# EAGLE design Lightpack7.0L (EAGLE 6.3)
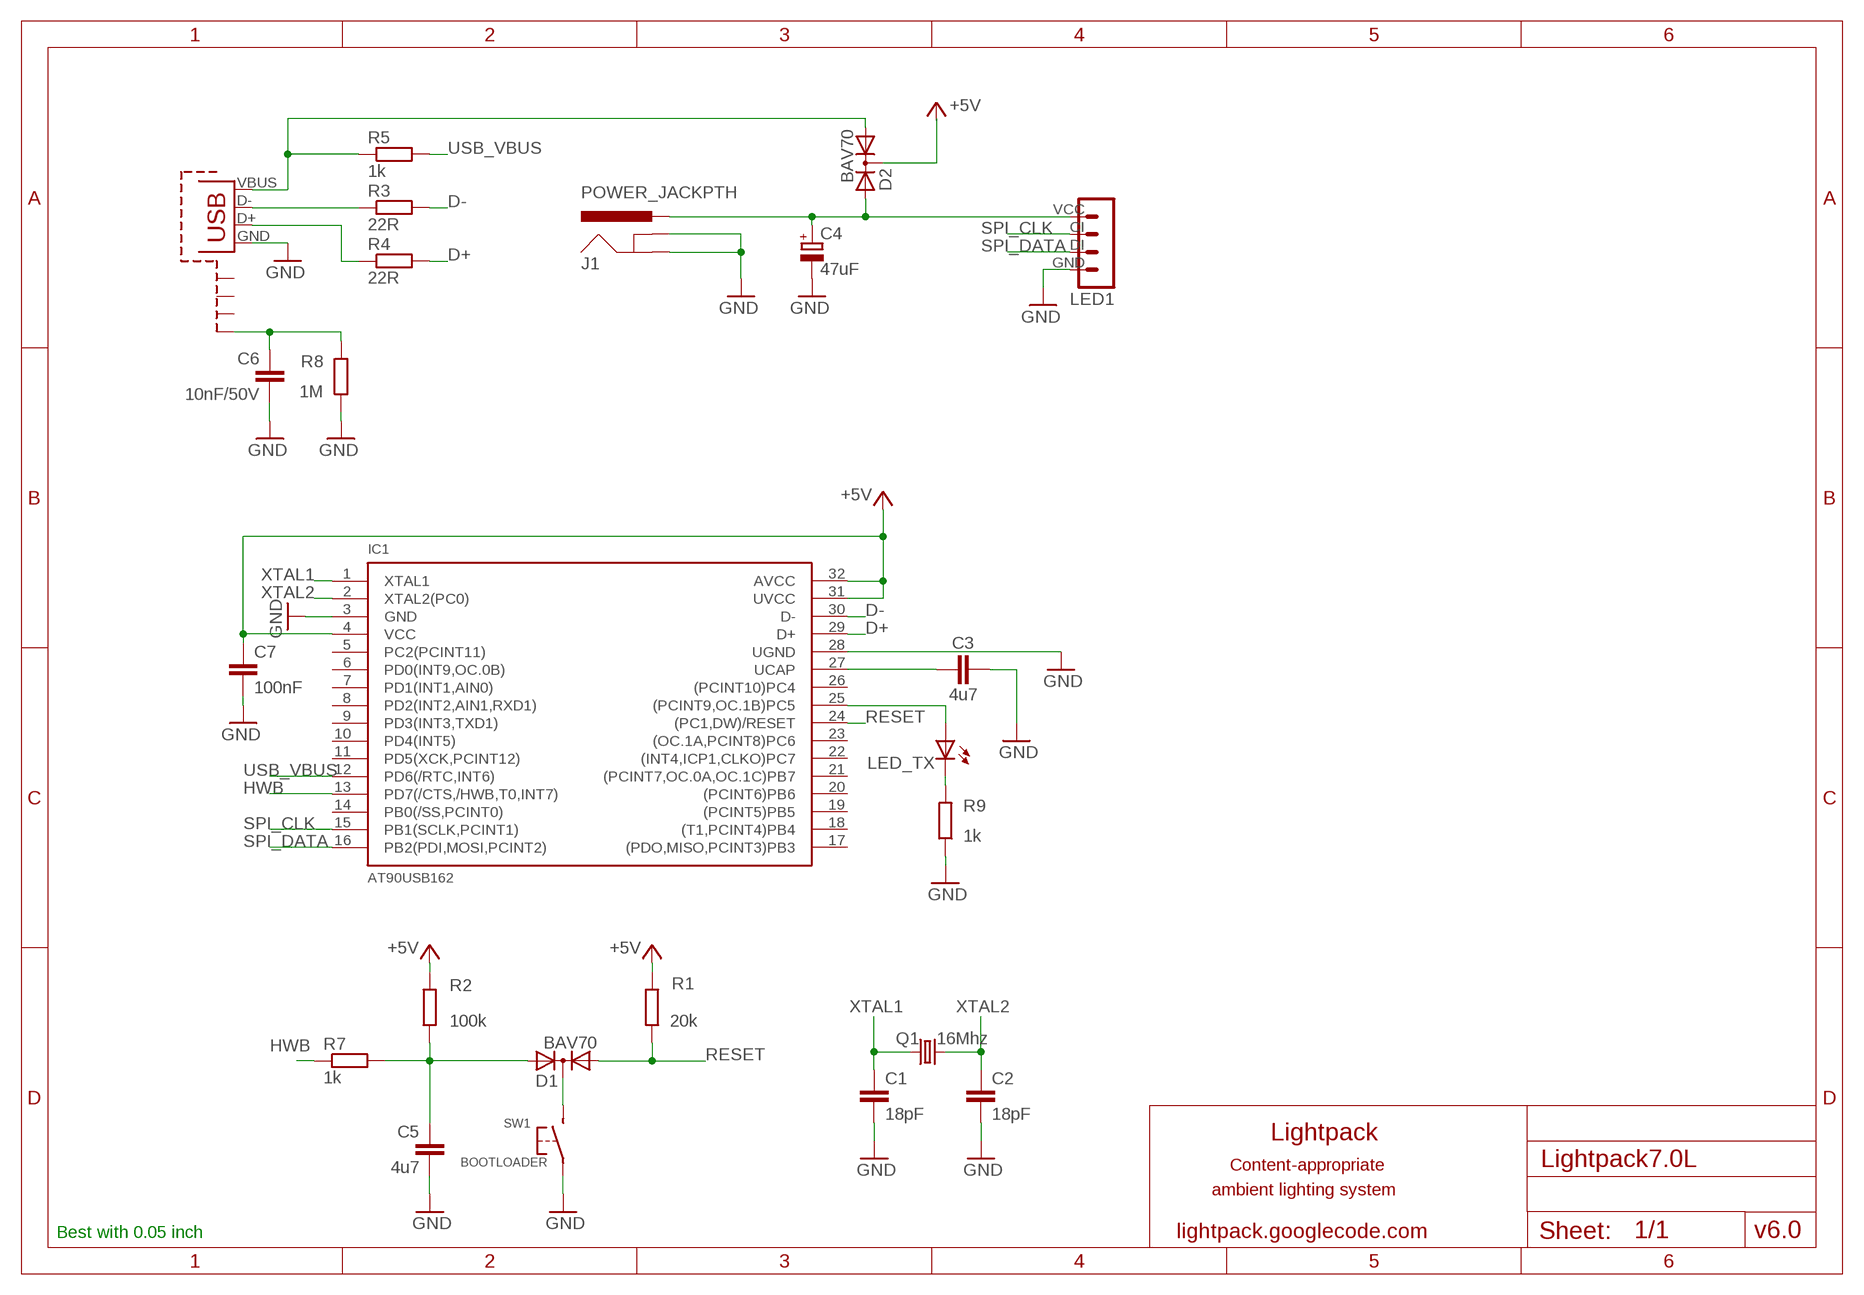
[diagram p0: schematic, sheet 1]

## Parts
C1  18pF  C-EUC1206  [C1206]
C2  18pF  C-EUC1206  [C1206]
C3  4u7  C-EUC1206  [C1206]
C4  47uF  CPOL-EUD/7343-31W  [D/7343-31W]
C5  4u7  C-EUC1206  [C1206]
C6  10nF/50V  C-EUC1206  [C1206]
C7  100nF  C-EUC1206  [C1206]
D1  BAV70  DIODE-2AC|CASOT23  [SOT23]
D2  BAV70  DIODE-2AC|CASOT23  [SOT23]
IC1  AT90USB162  [TQFP32]
J1  POWER_JACKPTH  [POWER_JACK_PTH]
LED1  RGB_LED_STRIP  [MA04-1]
LED_TX  GREEN  LEDCHIPLED_0805  [CHIPLED_0805]
Q1  16Mhz  CRYSTALHC49UP  [HC49UP]
R1  20k  R-EU_R1206  [R1206]
R2  100k  R-EU_R1206_2  [R1206]
R3  22R  R-EU_R1206  [R1206]
R4  22R  R-EU_R1206  [R1206]
R5  1k  R-EU_R1206  [R1206]
R7  1k  R-EU_R1206  [R1206]
R8  1M  R-EU_R1206  [R1206]
R9  1k  R-EU_R1206  [R1206]
SW1  BOOTLOADER  BUTTON  [BUTTON-SMD]
X1  USB-MB-S  [USB-MB-S]

## Nets
+5V [VCC]: C7.1 IC1.4(VCC) IC1.31(UVCC) IC1.32(AVCC) R1.2 R2.1
D+: IC1.29(D+) R4.2
D-: IC1.30(D-) R3.2
GND: C1.2 C2.2 C3.1 C4.- C5.2 C6.2 C7.2 IC1.3(GND) IC1.28(UGND) J1.GND J1.GNDBREAK LED1.GND R8.1 R9.1 SW1.1 X1.GND
HWB: IC1.13(PD7(/CTS,/HWB,T0,INT7)) R7.1
N$1: R4.1 X1.D+
N$2 [VCC]: D2.1(A1) R5.1 X1.VBUS
N$3: R3.1 X1.D-
N$5: D2.3(C)
N$6: C4.+ D2.2(A2) J1.PWR LED1.VCC
N$8: IC1.25((PCINT9,OC.1B)PC5) LED_TX.A
N$35: C6.1 R8.2 X1.SHIELD4
N$37: LED_TX.C R9.2
N$45: D1.3(C) SW1.2
N$47: C5.1 D1.2(A2) R2.2 R7.2
N$60: C3.2 IC1.27(UCAP)
RESET: D1.1(A1) IC1.24((PC1,DW)/RESET) R1.1
SPI_CLK: IC1.15(PB1(SCLK,PCINT1)) LED1.CI
SPI_DATA: IC1.16(PB2(PDI,MOSI,PCINT2)) LED1.DI
USB_VBUS: IC1.12(PD6(/RTC,INT6)) R5.2
XTAL1: C1.1 IC1.1(XTAL1) Q1.1
XTAL2: C2.1 IC1.2(XTAL2(PC0)) Q1.2
Unconnected: IC1.5(PC2(PCINT11)) IC1.6(PD0(INT9,OC.0B)) IC1.7(PD1(INT1,AIN0)) IC1.8(PD2(INT2,AIN1,RXD1)) IC1.9(PD3(INT3,TXD1)) IC1.10(PD4(INT5)) IC1.11(PD5(XCK,PCINT12)) IC1.14(PB0(/SS,PCINT0)) IC1.17((PDO,MISO,PCINT3)PB3) IC1.18((T1,PCINT4)PB4) IC1.19((PCINT5)PB5) IC1.20((PCINT6)PB6) IC1.21((PCINT7,OC.0A,OC.1C)PB7) IC1.22((INT4,ICP1,CLKO)PC7) IC1.23((OC.1A,PCINT8)PC6) IC1.26((PCINT10)PC4) X1.SHIELD1 X1.SHIELD2 X1.SHIELD3

## Notes on the sheet
- Lightpack
- Content-appropriate
- ambient lighting system
- Best with 0.05 inch | lightpack.googlecode.com | v6.0

## Library data of the parts
C1-C3 C5-C7 = rcl:C-EU: CAPACITOR, European symbol
C4 = rcl:CPOL-EU: POLARIZED CAPACITOR, European symbol
D1 D2 = diode:DIODE-2AC|CA: Dual DIODE Anode-Cathode|Cathode-Anode
IC1 = AT90USB:AT90USB162: AT90USB162 Author: brunql.github.com
J1 = SparkFun:POWER_JACK: Power Jack This is the standard 5.5mm barrel jack for power. The PTH is the most common, proven, reliable, footprint. All others are experimental. The Slot footprint only works if the mill layer is transmitted to the PCB fab house so be warned. Spark Fun Electronics SKU : PRT-00119. Mating wall wart : TOL-00298 (and others)
LED1 = _brd-conn:RGB_LED_STRIP: PIN HEADER
LED_TX = led:LED: LED OSRAM: - CHIPLED LG R971, LG N971, LY N971, LG Q971, LY Q971, LO R971, LY R971 LH N974, LH R974 LS Q976, LO Q976, LY Q976 LO Q996 - Hyper CHIPLED LW Q18S LB Q993, LB Q99A, LB R99A - SideLED LS A670, LO A670, LY A670, LG A670, LP A670 LB A673, LV A673, LT A673, LW A673 LH A674 LY A675 LS A676, LA A676, LO A676, LY A676, LW A676 LS A679, LY A679, LG A679 - Hyper Micro SIDELED® LS Y876, LA Y876, LO Y876, LY Y876 LT Y87S - SmartLED LW L88C, LW L88S LB L89C, LB L89S, LG L890 LS L89K, LO L89K, LY L89K LS L896, LA L896, LO L896, LY L896 - TOPLED LS T670, LO T670, LY T670, LG T670, LP T670 LSG T670, LSP T670, LSY T670, LOP T670, LYG T670 LG T671, LOG T671, LSG T671 LB T673, LV T673, LT T673, LW T673 LH T674 LS T676, LA T676, LO T676, LY T676, LB T676, LH T676, LSB T676, LW T676 LB T67C, LV T67C, LT T67C, LS T67K, LO T67K, LY T67K, LW E67C LS E67B, LA E67B, LO E67B, LY E67B, LB E67C, LV E67C, LT E67C LW T67C LS T679, LY T679, LG T679 LS T770, LO T770, LY T770, LG T770, LP T770 LB T773, LV T773, LT T773, LW T773 LH T774 LS E675, LA E675, LY E675, LS T675 LS T776, LA T776, LO T776, LY T776, LB T776 LHGB T686 LT T68C, LB T68C - Hyper Mini TOPLED® LB M676 - Mini TOPLED Santana® LG M470 LS M47K, LO M47K, LY M47K Source: http://www.osram.convergy.de LUXEON: - LUMILED® LXK2-PW12-R00, LXK2-PW12-S00, LXK2-PW14-U00, LXK2-PW14-V00 LXK2-PM12-R00, LXK2-PM12-S00, LXK2-PM14-U00 LXK2-PE12-Q00, LXK2-PE12-R00, LXK2-PE12-S00, LXK2-PE14-T00, LXK2-PE14-U00 LXK2-PB12-K00, LXK2-PB12-L00, LXK2-PB12-M00, LXK2-PB14-N00, LXK2-PB14-P00, LXK2-PB14-Q00 LXK2-PR12-L00, LXK2-PR12-M00, LXK2-PR14-Q00, LXK2-PR14-R00 LXK2-PD12-Q00, LXK2-PD12-R00, LXK2-PD12-S00 LXK2-PH12-R00, LXK2-PH12-S00 LXK2-PL12-P00, LXK2-PL12-Q00, LXK2-PL12-R00 Source: www.luxeon.com KINGBRIGHT: KA-3528ASYC Source: www.kingbright.com
Q1 = crystal:CRYSTAL: CRYSTAL; OC_FARNELL: unknown; OC_NEWARK: unknown
R1 R2 = br-zero-res:R-EU_: RESISTOR, European symbol
R3-R5 R7-R9 = rcl:R-EU_: RESISTOR, European symbol
SW1 = button-smd:BUTTON: Button SMD
X1 = USB_miniB:USB: USB Connector miniUSB type B

## Net classes
1 VCC: width 0.6 mm, clearance 0.6 mm

## Board
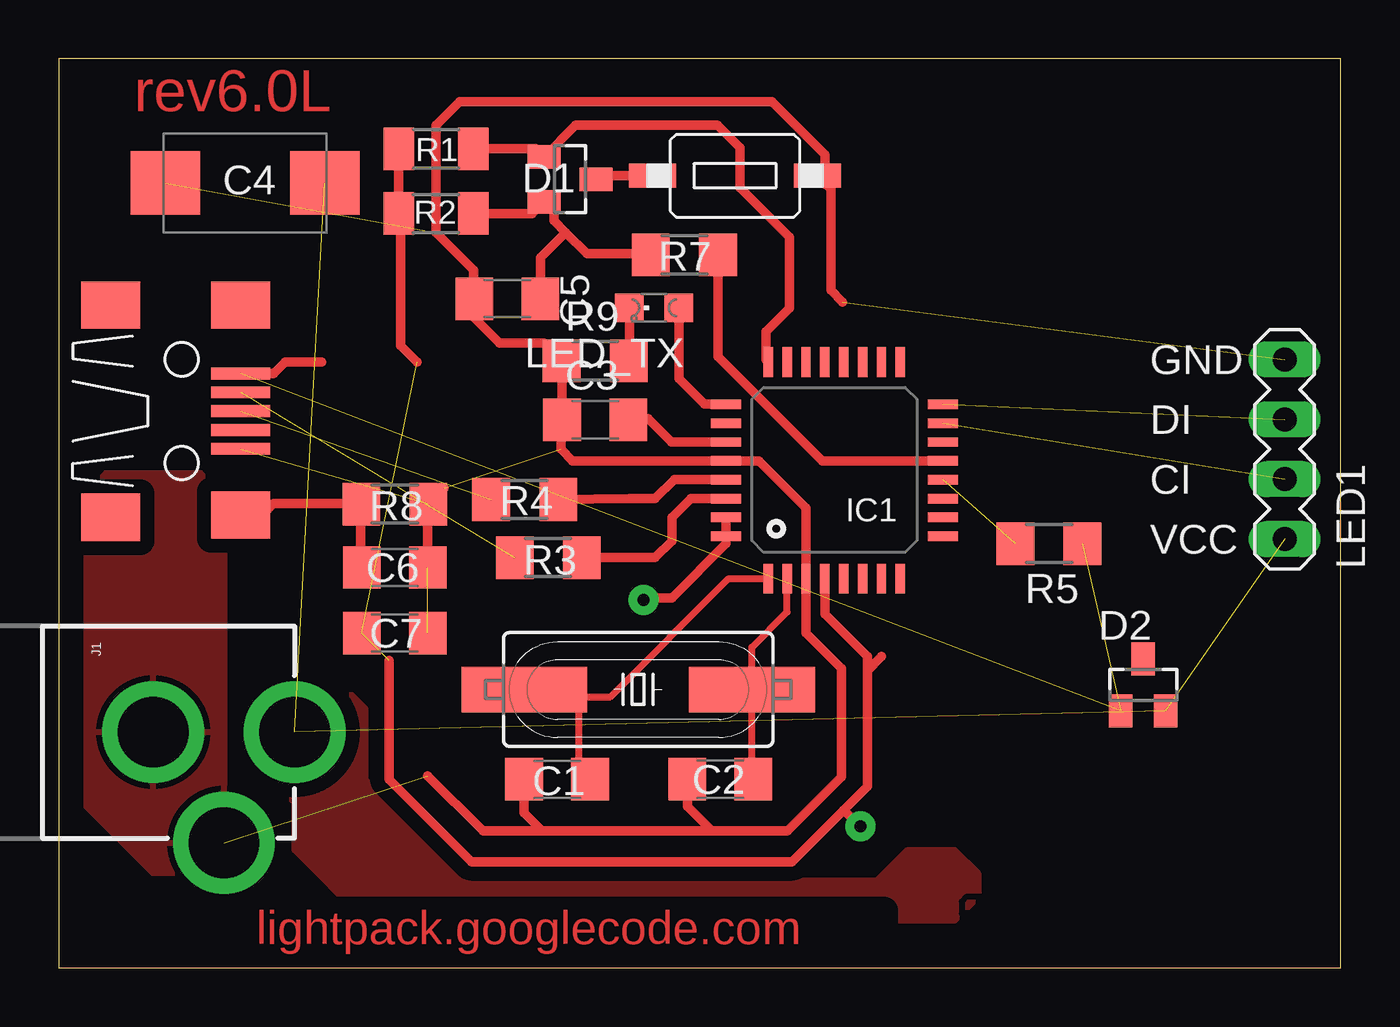
[diagram p1: board, top side]
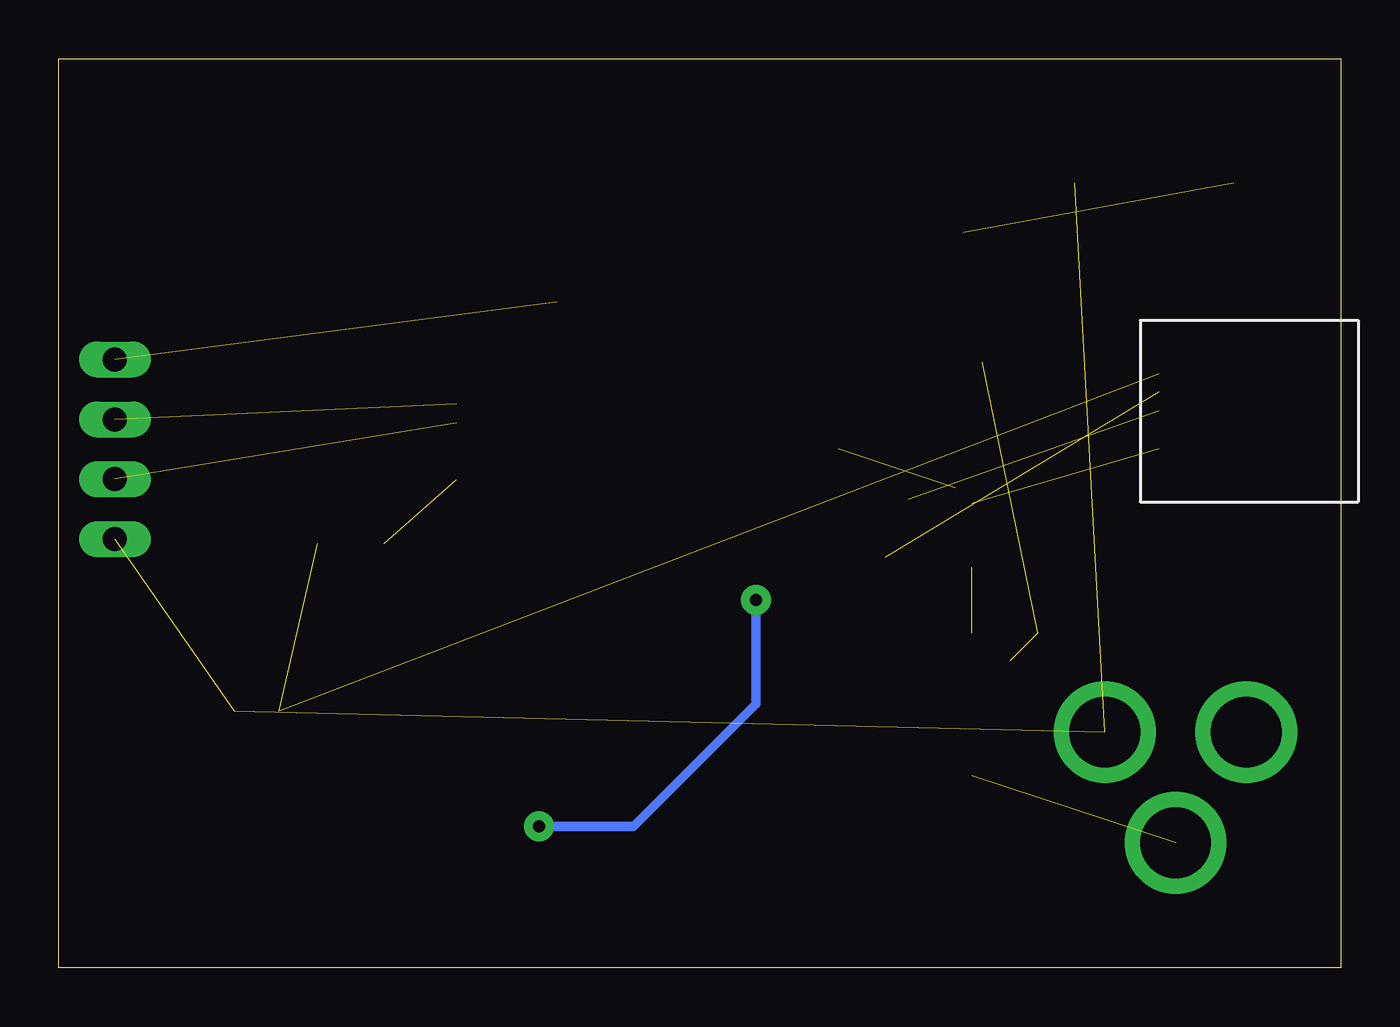
[diagram p2: board, bottom side, seen from below]

Size 54.38 x 38.56 mm. Coordinates in mm from the lower left corner, seen from the top.
Outline: 0,0 54.38,0 54.38,38.56 0,38.56 0,0
Copper layers (1*16): Top 0.035mm / dielectric 1.5mm / Bottom 0.035mm
Design rules "default": minimum track width 10mil, minimum drill 24mil, track to track 8mil, track to pad 8mil, pad to pad 8mil, via to via 8mil, smd to smd 8mil, copper to edge 40mil, drill to drill 8mil, minimum pad ring 10mil, minimum via ring 8mil, stop-mask expansion 4mil, vias tented up to drill 0mil, thermal gap 10mil
tRestrict: 7 lines

### Footprints (pad centres in the part's own frame; a part is rotated, then mirrored left to right if it is on the bottom)
C1206 = smd 1.6 x 1.8: 1 -1.4,0; 2 1.4,0
D/7343-31W = smd 2.95 x 2.7: + 3.375,0; - -3.375,0
SOT23 = smd 1 x 1.4: 1 -0.95,-1.1; 2 0.95,-1.1; 3 0,1.1
TQFP32 = smd 1.27 x 0.4: 1 -4.61,2.82; 2 -4.61,2.02; 3 -4.61,1.22; 4 -4.61,0.42; 5 -4.61,-0.38; 6 -4.61,-1.18; 7 -4.61,-1.98; 8 -4.61,-2.78; 17 4.59,-2.78; 18 4.59,-1.98; 19 4.59,-1.18; 20 4.59,-0.38; 21 4.59,0.42; 22 4.59,1.22; 23 4.59,2.02; 24 4.59,2.82 | smd 0.4 x 1.27: 9 -2.81,-4.58; 10 -2.01,-4.58; 11 -1.21,-4.58; 12 -0.41,-4.58; 13 0.39,-4.58; 14 1.19,-4.58; 15 1.99,-4.58; 16 2.79,-4.58; 25 2.79,4.62; 26 1.99,4.62; 27 1.19,4.62; 28 0.39,4.62; 29 -0.41,4.62; 30 -1.21,4.62; 31 -2.01,4.62; 32 -2.81,4.62
POWER_JACK_PTH = drill 2.997 pad 4.318: GND 0,7.7; GNDBREAK 4.7,10.7; PWR 0,13.7
MA04-1 = drill 1.016 long: CI 0,-1.27; DI 0,1.27; GND 0,3.81; VCC 0,-3.81
CHIPLED_0805 = smd 1.2 x 1.2: A 0,-1.05; C 0,1.05
HC49UP = smd 5.334 x 1.93: 1 -4.826,0; 2 4.826,0
R1206 = smd 1.3 x 1.803: 1 -1.581,0; 2 1.581,0
R1206' = smd 1.6 x 1.803: 1 -1.422,0; 2 1.422,0
BUTTON-SMD = smd 2 x 1: 1 -3.5,0; 2 3.5,0
USB-MB-S = smd 2.5 x 0.5: D+ 2.5,0; D- 2.5,0.8; GND 2.5,-1.6; ID 2.5,-0.8; VBUS 2.5,1.6 | smd 2.5 x 2: SHIELD1 2.5,4.5; SHIELD2 -3,4.5; SHIELD3 -3,-4.5; SHIELD4 2.5,-4.4

### Placement (x,y rotation side)
C1  21.14,8 180 top
C2  28.06,8 180 top
C3  22.75,23.25 0 top
C4  7.9,33.3 0 top
C5  19.03,28.39 180 top
C6  14.25,16.98 0 top
C7  14.25,14.2 0 top
D1  21.68,33.45 270 top
D2  46,12 0 top
IC1  32.91,21.12 90 top
J1  -3.7,10 270 top
LED1  52,22 0 top
LED_TX  25.25,28 90 top
Q1  24.57,11.81 0 top
R1  16,34.75 180 top
R2  16,32 0 top
R3  22R  [R1206']  20.76,17.41 0 top
R4  22R  [R1206']  19.76,19.87 0 top
R5  1k  [R1206']  42,18 180 top
R7  1k  [R1206']  26.54,30.25 180 top
R8  1M  [R1206']  14.25,19.68 180 top
R9  1k  [R1206']  22.75,25.75 0 top
SW1  28.69,33.61 180 top
X1  5.21,23.62 0 top

### Tracks (layer width: path | path; a pad name or v marks a point on that pad's centre or on a via)
+5V  (via drill 0.5 pad 1.27)  (2 unrouted)
  Top 0.406: 15.2,25.7 14.5,26.4 14.5,31.92 R2.1 | R2.1 14.42,32.83 | R2.1 R1.2 | IC1.31 IC1.32 28.3,18 26,15.7 24.9,15.7 v24.8,15.6 | IC1.4 32.49,15.01 34.3,13.2 34.3,12.6 | 34.3,12.6 34.9,13.2 | v34,6 33.31,6.69 33.29,6.69 | 34.3,12.6 34.3,7.7 33.29,6.69 | 14,13.05 14,8 17.5,4.5 31.1,4.5 33.29,6.69
  Bottom 0.406: v24.8,15.6 24.8,11.2 30,6 v34,6
D+
  Top 0.406: IC1.29 26.11,20.71 25.3,19.9 24.21,19.9 R4.2
D-
  Top 0.406: IC1.30 26.81,19.91 26,19.1 26,18.1 25.3,17.4 24.19,17.4 R3.2
GND  (6 unrouted)
  Top 0.406: 33.25,28.25 32.75,28.75 32.75,33.04 SW1.1 32.5,33.29 | C6.2 15.65,19.65 R8.1 | 32.5,33.29 32.5,34.5 30.25,36.75 17,36.75 16,35.75 16,31.2 17.6,29.6 17.6,28.41 C5.2 17.6,28.36 17.6,27.6 18.7,26.5 20.58,26.5 R9.1 21.35,25.73 C3.1 21.3,23.2 21.3,22 21.79,21.51 IC1.28 29.7,21.5 31.7,19.5 IC1.3 31.7,14.21 33.2,12.7 33.2,8.1 30.9,5.8 27.7,5.8 | 32.5,33.29 32.5,33.25 | 20.5,5.8 27.7,5.8 | C2.2 26.66,6.84 27.7,5.8 | C1.2 19.73,6.57 20.5,5.8 | R8.1 15.75,19.6 | R8.1 15.65,19.7 | 20.5,5.8 18,5.8 15.65,8.15 | R8.1 16.35,20.35
  pour Top (isolate 0.61): 1,7 1,20 2,21 6,21 7,20 7,4 4,4
HWB
  Top 0.406: R7.1 27.96,25.94 32.4,21.5 IC1.13
N$1  (1 unrouted)
N$2  (2 unrouted)
  Top 0.406: X1.VBUS 9.12,25.22 9.6,25.7 11.14,25.7
N$3  (1 unrouted)
N$6  (3 unrouted)
N$8
  Top 0.406: IC1.25 27.39,23.91 26.3,25 LED_TX.A
N$35
  Top 0.406: 12.83,17.01 C6.1 12.8,17.03 12.8,19.7 | X1.SHIELD4 8.62,19.22 9.1,19.7 12.8,19.7 | 12.8,19.7 R8.2
N$37
  Top 0.406: LED_TX.C 24.2,25.78 R9.2
N$45
  Top 0.406: SW1.2 22.93,33.61 D1.3
N$47
  Top 0.406: 17.43,31.85 R2.2 20.08,32 D1.2 21,32.5 21,31.7 21.5,31.2 | 21.5,31.2 22.4,30.3 25.07,30.3 R7.2 | C5.1 20.43,30.13 21.5,31.2
N$57
  pour Top: 8,10 8,11 9,12 12,12 13,11 13,8 17,4 17.3,3.7 34.7,3.7 36,5 38,5 39,4 39,3 38,2 13,2 10,5 10,7 8,9
N$60
  Top 0.406: IC1.27 25.99,22.31 25,23.3 24.2,23.3 C3.2
RESET
  Top 0.406: R1.1 20.23,34.75 D1.1 21.93,35.75 27.95,35.75 28.9,34.8 28.9,33.1 31,31 31,28 30,27 30,25.8 IC1.24
SPI_CLK  (1 unrouted)
SPI_DATA  (1 unrouted)
USB_VBUS  (1 unrouted)
XTAL1
  Top 0.305: 21.07,11.54 20.02,11.54 Q1.1 20.8,11.81 21.07,11.54 | 21.07,11.54 22.07,11.54 22.07,8.46 C1.1 | IC1.1 28.41,16.51 23.4,11.5 21.11,11.5 21.07,11.54
XTAL2
  Top 0.305: 30.58,11.79 30.55,11.81 Q1.2 | Q1.2 29.33,11.88 | IC1.2 30.9,15.1 29.4,13.6 Q1.2 | Q1.2 29.4,8.06 C2.1

### Text on the board
Top: rev6.0L | lightpack.googlecode.com